# EAGLE schematic ym2612play (EAGLE 6.4)
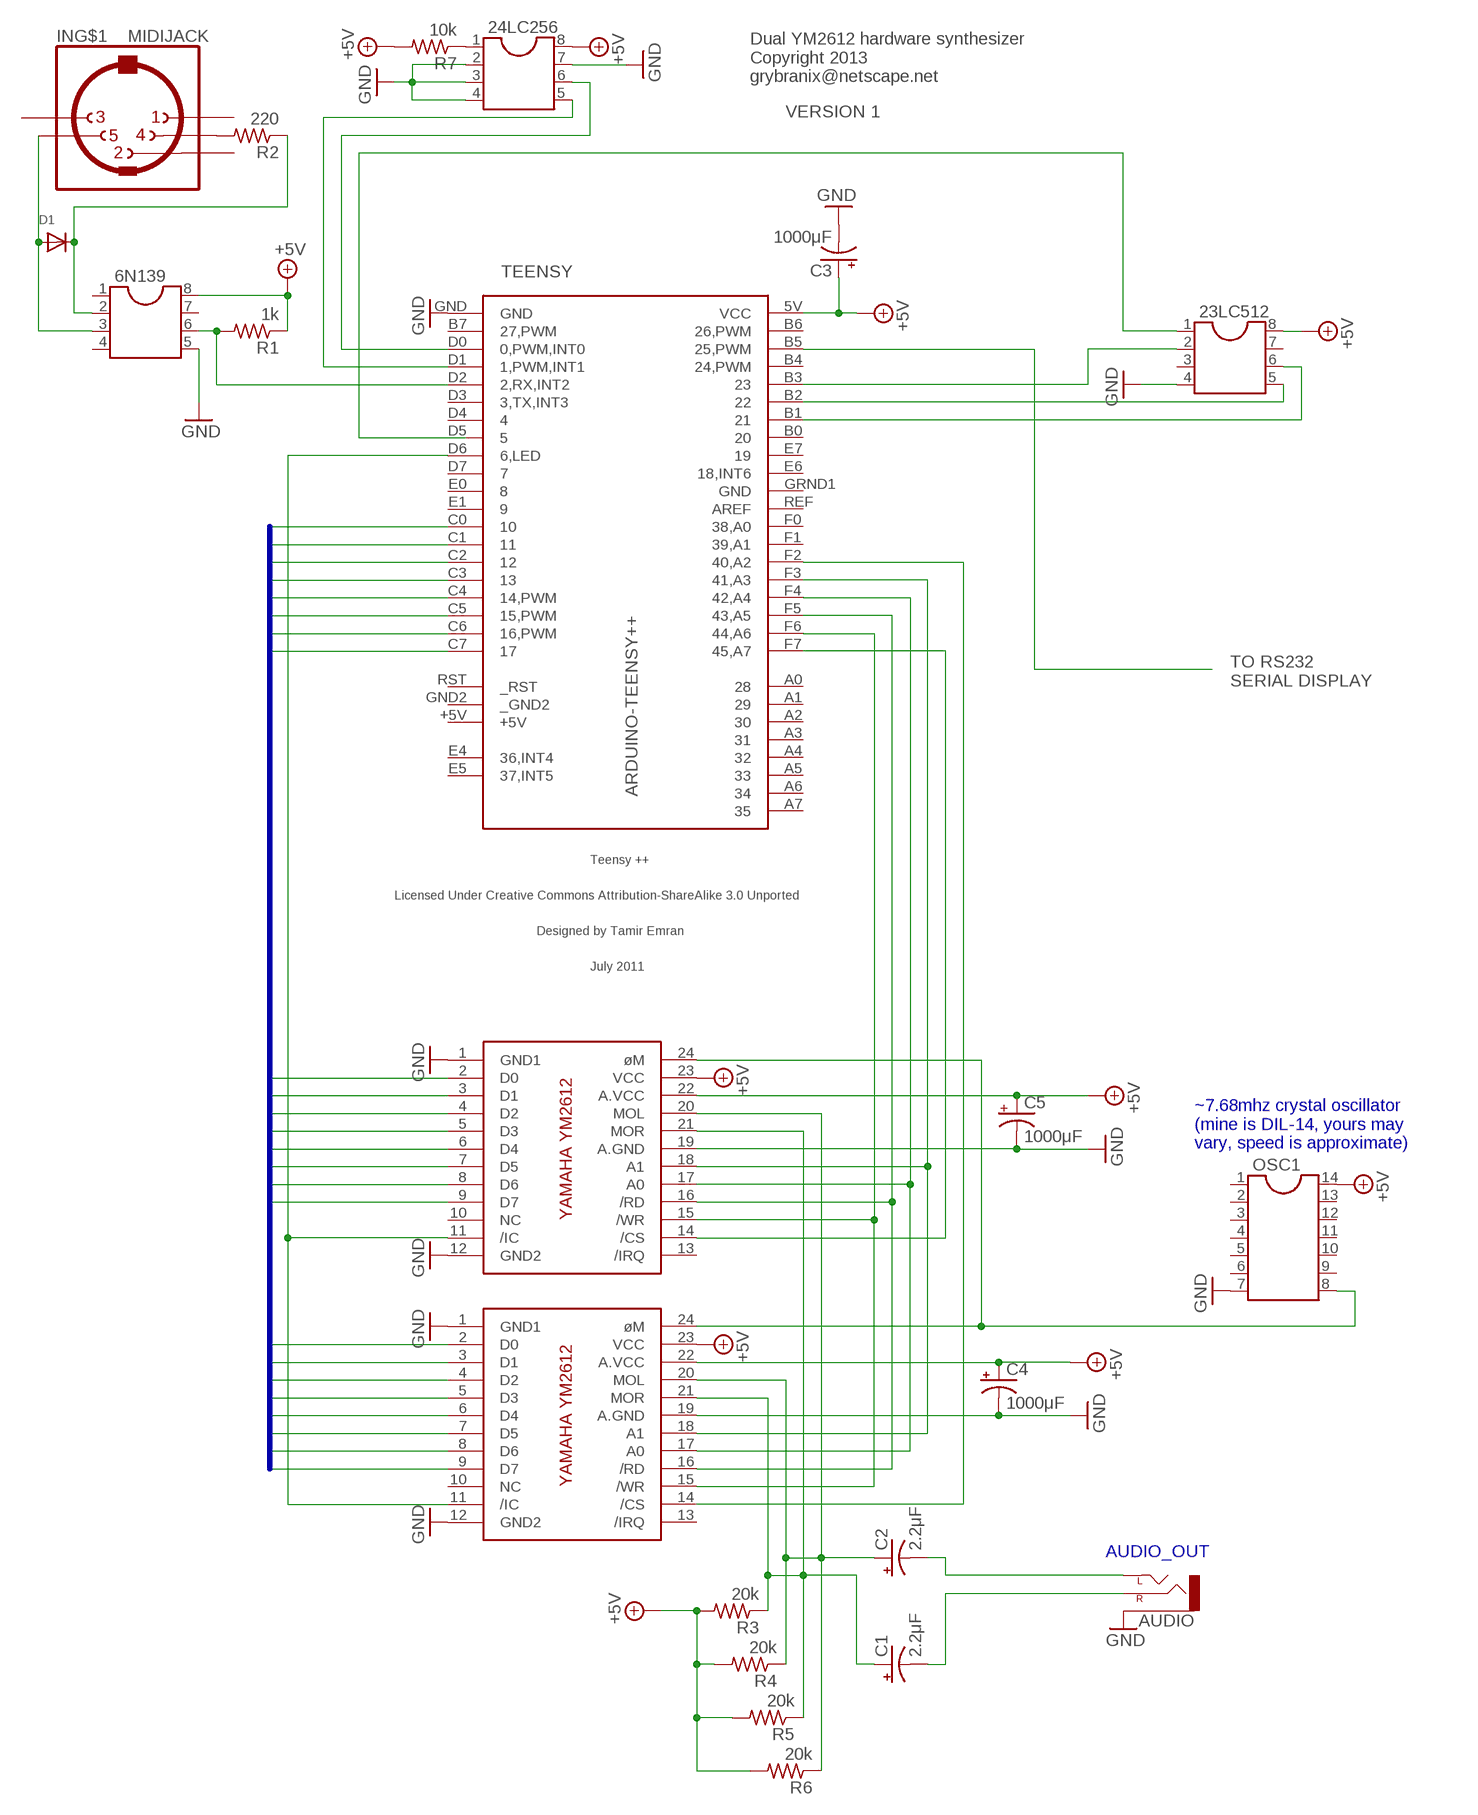
[diagram p0: schematic, sheet 1]

## Parts
6N139  DIL8  [DIL08]
23LC512  DIL8  [DIL08]
24LC256  DIL8  [DIL08]
AUDIO  AUDIO-JACK2.5MM  [STEREOJACK2.5MM_STEREOJACK2.5MM]
C1  2.2μF  CPOL-USB45181B  [B45181B]
C2  2.2μF  CPOL-USB45181B  [B45181B]
C3  1000μF  CPOL-USB45181B  [B45181B]
C4  1000μF  CPOL-USB45181B  [B45181B]
C5  1000μF  CPOL-USB45181B  [B45181B]
D1  DIODEDO-1N4148  [DO-1N4148]
IN  MIDIJACK  [CP-2350]
OSC1  DIL14  [DIL14]
R1  1k  R-US_0207/5V  [0207/5V]
R2  220  R-US_0207/5V  [0207/5V]
R3  20k  R-US_0207/5V  [0207/5V]
R4  20k  R-US_0207/5V  [0207/5V]
R5  20k  R-US_0207/5V  [0207/5V]
R6  20k  R-US_0207/5V  [0207/5V]
R7  10k  R-US_0207/5V  [0207/5V]
TEENSY  ARDUINO-TEENSY++  [TEENSY++]
YM2612#1  YM2612  [DIL24-6]
YM2612#2  YM2612  [DIL24-6]

## Nets
+5V: 6N139.8 23LC512.8 24LC256.8 C3.+ C4.+ C5.+ OSC1.14 R1.1 R3.2 R4.2 R5.2 R6.2 R7.2 TEENSY.5V(VCC) YM2612#1.22(A.VCC) YM2612#1.23(VCC) YM2612#2.22(A.VCC) YM2612#2.23(VCC)
DATA0: TEENSY.C0 YM2612#1.2(D0) YM2612#2.2(D0)
DATA1: TEENSY.C1 YM2612#1.3(D1) YM2612#2.3(D1)
DATA2: TEENSY.C2 YM2612#1.4(D2) YM2612#2.4(D2)
DATA3: TEENSY.C3 YM2612#1.5(D3) YM2612#2.5(D3)
DATA4: TEENSY.C4(14,PWM) YM2612#1.6(D4) YM2612#2.6(D4)
DATA5: TEENSY.C5(15,PWM) YM2612#1.7(D5) YM2612#2.7(D5)
DATA6: TEENSY.C6(16,PWM) YM2612#1.8(D6) YM2612#2.8(D6)
DATA7: TEENSY.C7 YM2612#1.9(D7) YM2612#2.9(D7)
GND: 6N139.5 23LC512.4 24LC256.2 24LC256.3 24LC256.4 24LC256.7 AUDIO.RING1(SLEEVE) C3.- C4.- C5.- OSC1.7 TEENSY.GND YM2612#1.1(GND1) YM2612#1.12(GND2) YM2612#1.19(A.GND) YM2612#2.1(GND1) YM2612#2.12(GND2) YM2612#2.19(A.GND)
N$1: TEENSY.D6(6,LED) YM2612#1.11(/IC) YM2612#2.11(/IC)
N$2: TEENSY.F7(45,A7) YM2612#1.14(/CS)
N$3: TEENSY.F2(40,A2) YM2612#2.14(/CS)
N$4: TEENSY.F3(41,A3) YM2612#1.18(A1) YM2612#2.18(A1)
N$5: TEENSY.F4(42,A4) YM2612#1.17(A0) YM2612#2.17(A0)
N$6: TEENSY.F5(43,A5) YM2612#1.16(/RD) YM2612#2.16(/RD)
N$7: TEENSY.F6(44,A6) YM2612#1.15(/WR) YM2612#2.15(/WR)
N$8: OSC1.8 YM2612#1.24(øM) YM2612#2.24(øM)
N$9: IN.4 R2.2
N$11: 6N139.3 D1.A IN.5
N$12: 6N139.2 D1.C R2.1
N$13: C1.+ R3.1 R5.1 YM2612#1.21(MOR) YM2612#2.21(MOR)
N$14: C2.+ R4.1 R6.1 YM2612#1.20(MOL) YM2612#2.20(MOL)
N$15: 24LC256.1 R7.1
N$16: AUDIO.TIP(RIGHT) C1.-
N$17: AUDIO.SHIELD(LEFT) C2.-
N$18: 24LC256.5 TEENSY.D1(1,PWM,INT1)
N$19: 24LC256.6 TEENSY.D0(0,PWM,INT0)
N$20: 23LC512.5 TEENSY.B2
N$21: 23LC512.6 TEENSY.B1
N$22: 23LC512.1
N$23: 23LC512.2 TEENSY.B3
N$24: TEENSY.B5(25,PWM)
N$25: 6N139.6 R1.2 TEENSY.D2(2,RX,INT2)
Unconnected: 6N139.1 6N139.4 6N139.7 23LC512.3 23LC512.7 IN.1 IN.2 IN.3 IN.PE1(MT) IN.PE2(MT) IN.PE(MT) IN.PE@(MT) OSC1.1 OSC1.2 OSC1.3 OSC1.4 OSC1.5 OSC1.6 OSC1.9 OSC1.10 OSC1.11 OSC1.12 OSC1.13 TEENSY.A0 TEENSY.A1 TEENSY.A2 TEENSY.A3 TEENSY.A4 TEENSY.A5 TEENSY.A6 TEENSY.A7 TEENSY.B0 TEENSY.B4(24,PWM) TEENSY.B6(26,PWM) TEENSY.B7(27,PWM) TEENSY.D3(3,TX,INT3) TEENSY.D4 TEENSY.D5 TEENSY.D7 TEENSY.E0 TEENSY.E1 TEENSY.E4(36,INT4) TEENSY.E5(37,INT5) TEENSY.E6(18,INT6) TEENSY.E7 TEENSY.F0(38,A0) TEENSY.F1(39,A1) TEENSY.REF(AREF) TEENSY.RST(_RST) YM2612#1.10(NC) YM2612#1.13(/IRQ) YM2612#2.10(NC) YM2612#2.13(/IRQ)

## Buses
DATA[0..7]

## Notes on the sheet
- Dual YM2612 hardware synthesizer
  Copyright 2013
  grybranix@netscape.net
- VERSION 1
- TO RS232
  SERIAL DISPLAY
- ~7.68mhz crystal oscillator
  (mine is DIL-14, yours may
  vary, speed is approximate)
- AUDIO_OUT

## Power pins joined to a net without a drawn wire
+5V: TEENSY.+5V
_GND2: TEENSY.GND2(_GND2)
GND: TEENSY.GRND1(GND)

## Library data of the parts
6N139 23LC512 24LC256 = ic-package:DIL8: Dual In Line / Socket
AUDIO = SparkFun-Connectors:AUDIO-JACK: 3.5mm Audio Jack Simple 3.5mm common PCB mount audio jack. SKU: PRT-08032
C1-C5 = adafruit:CPOL-US: POLARIZED CAPACITOR, American symbol
D1 = adafruit:DIODE: Diode SMADIODE - SMA Surface Mount Package 20V 1A Schottky Diode Digikey: 641-1014-6-ND DO-1N4148 - Through Hole Small Current Diode SOD-123 20V 1 A (.5mV Vf) Schottky Diode - Digikey: MBRX120TPMSCT-ND SOD-323 10V 570mA (.38mV Vf, 3ns) Schottky Diode - Digikey: ZLLS410CT-ND SOD-523 30V 30mA Schottky Diode (RB751S-40TE61) - Digikey: RB751S-40TE61CT-ND SOT23-R/W - SOT23 Package (R = Solder Paste/Reflow Ovens, W = Hand-Soldering) BAT54Film 40V 300mA - Digikey: 497-7162-1-ND
IN = adafruit:MIDIJACK: DIN 5 jack also known as MIDI jack A modification of conn-hirshman:MAB5SH with two options for the grounding 'teeth'
OSC1 = ic-package:DIL14: Dual In Line / Socket
R1-R7 = adafruit:R-US_: RESISTOR, American symbol
TEENSY = teensypp:ARDUINO-TEENSY++: Teensy ++ Original Design by Mark Gross Modified Design by Tamir Emran Licensed Under Creative Commons Attribution-ShareAlike 3.0 Unported (CC BY-SA 3.0)
YM2612#1 YM2612#2 = ranix:YM2612